# EAGLE design Solar-Charger-Board (EAGLE 8.1.1)
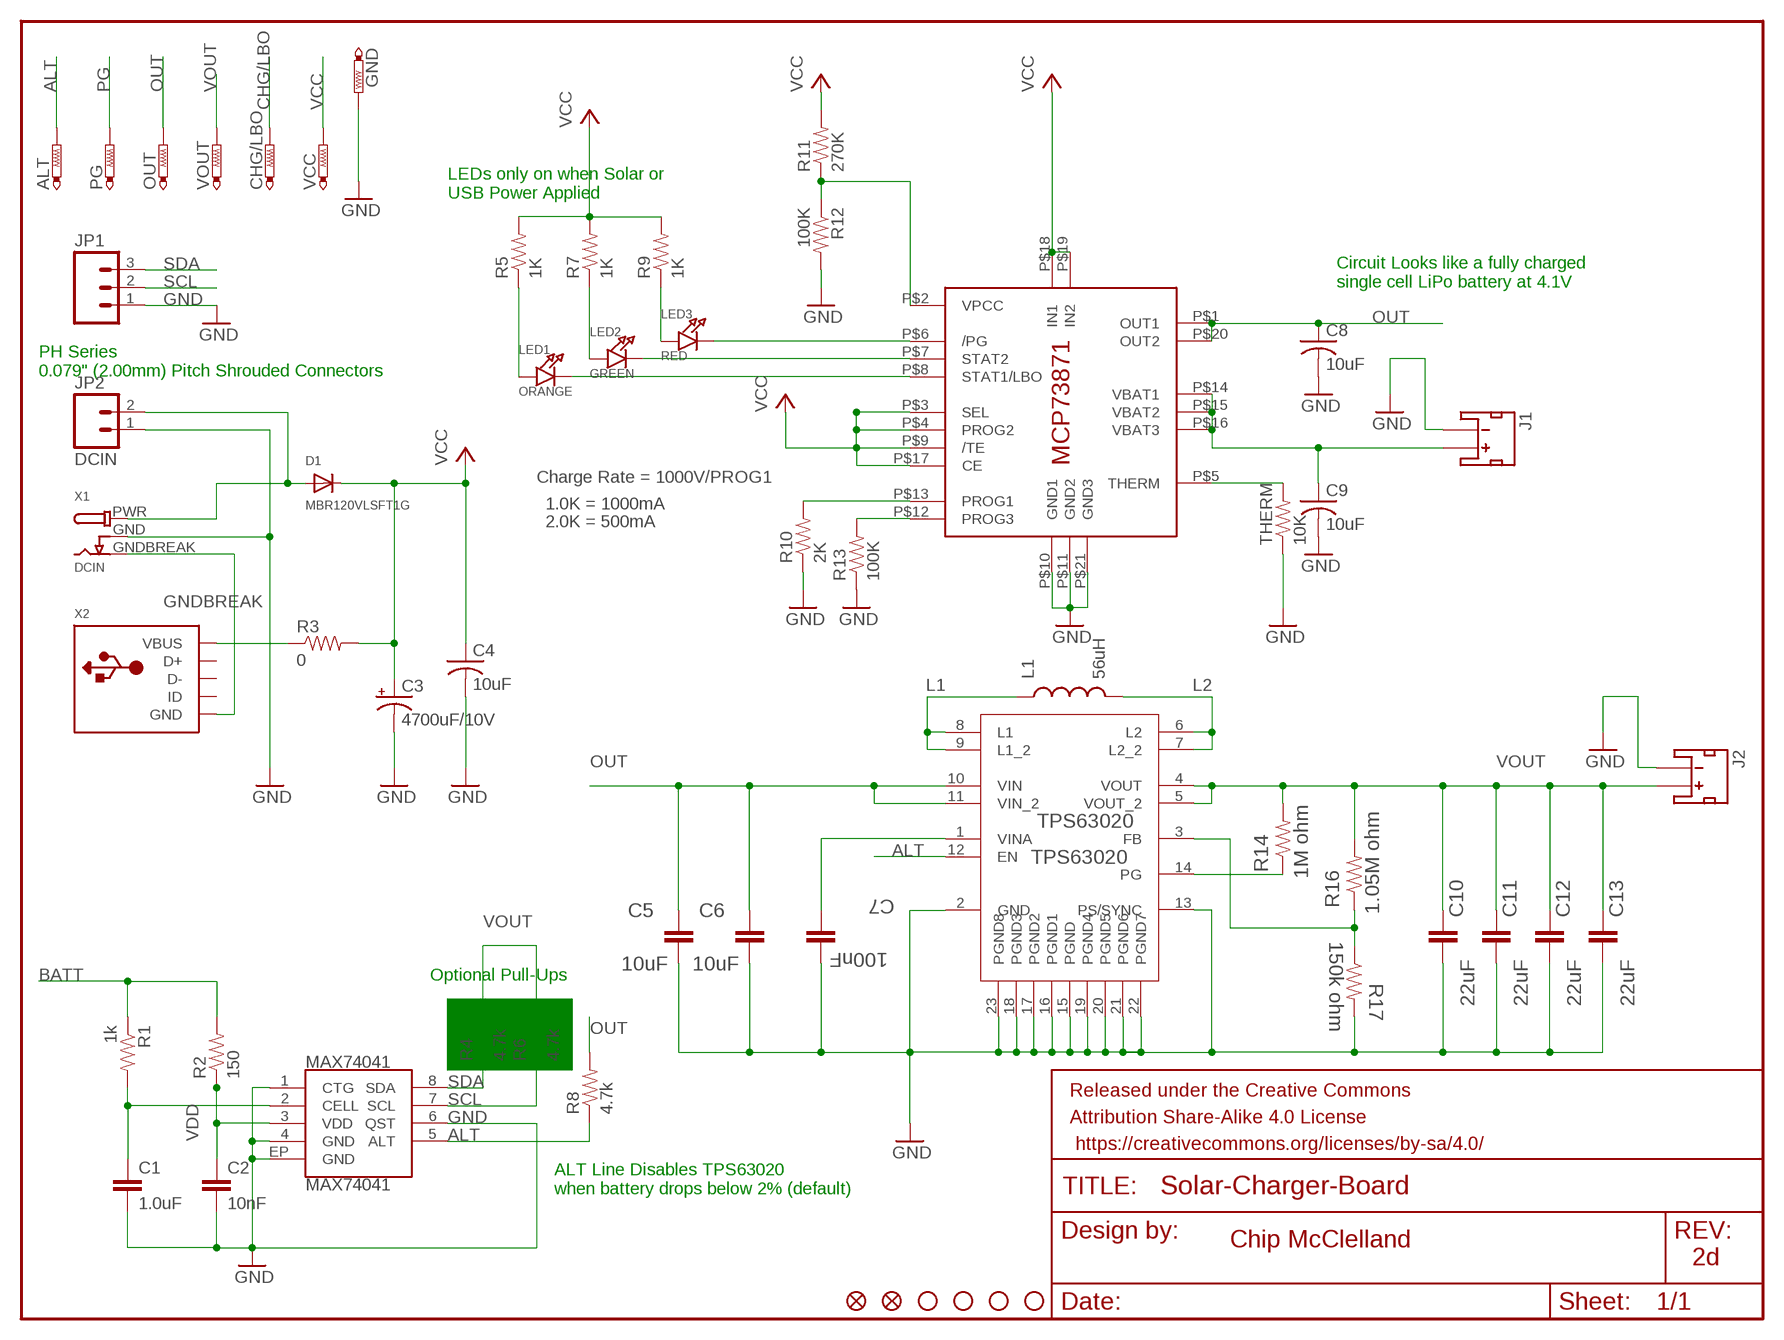
[diagram p0: schematic, sheet 1]

## Parts
ALT  PTR1TP09R  [TP09R]
C1  1.0uF  1.0UF-25V-+80/-20(0805)  [0805]
C2  10nF  2.2UF-25V-+80/-20(0805)  [0805]
C3  4700uF/10V  CPOL-USE5-13  [E5-13]
C4  10uF  C-USC0805K  [C0805K]
C5  10uF  CAP0805  [0805]
C6  10uF  CAP0805  [0805]
C7  100nF  CAP0805  [0805]
C8  10uF  C-USC0805K  [C0805K]
C9  10uF  C-USC0805K  [C0805K]
C10  22uF  CAP0805  [0805]
C11  22uF  CAP0805  [0805]
C12  22uF  CAP0805  [0805]
C13  22uF  CAP0805  [0805]
CHG/LBO  PTR1TP09R  [TP09R]
D1  MBR120VLSFT1G  DIODESOD-123  [SOD-123]
FID1  FIDUCIALUFIDUCIAL  [MICRO-FIDUCIAL]
FID2  FIDUCIALUFIDUCIAL  [MICRO-FIDUCIAL]
FRAME1  FRAME-LETTER  [CREATIVE_COMMONS]
GND  PTR1TP09R  [TP09R]
J1  JST_2MM_MALE  [JST-2-SMD]
J2  JST_2MM_MALE  [JST-2-SMD]
JP1  M03LOCK  [1X03_LOCK]
JP2  DCIN  M02LOCK  [1X02_LOCK]
JP3  STAND-OFF  [STAND-OFF]
JP4  STAND-OFF  [STAND-OFF]
JP5  STAND-OFF  [STAND-OFF]
JP6  STAND-OFF  [STAND-OFF]
L1  56uH  INDUCTORSDR0403-560KL  [SDR0403]
LED1  ORANGE  LED0805_NOOUTLINE  [CHIPLED_0805_NOOUTLINE]
LED2  GREEN  LED0805_NOOUTLINE  [CHIPLED_0805_NOOUTLINE]
LED3  RED  LED0805_NOOUTLINE  [CHIPLED_0805_NOOUTLINE]
MAX74041  MAX74041  MAX1704X  [TDFN-8]
MCP73871  U1  MCP73871  [QFN20_4MM]
OUT  PTR1TP09R  [TP09R]
PG  PTR1TP09R  [TP09R]
R1  1k  RESISTOR0805-RES  [0805]
R2  150  RESISTOR0805-RES  [0805]
R3  0  RESISTOR0805-RES  [0805]
R4  4.7k  RESISTOR0805-RES  [0805]
R5  1K  RESISTOR0805-RES  [0805]
R6  4.7k  RESISTOR0805-RES  [0805]
R7  1K  RESISTOR0805-RES  [0805]
R8  4.7k  RESISTOR0805-RES  [0805]
R9  1K  RESISTOR0805-RES  [0805]
R10  2K  RESISTOR0805-RES  [0805]
R11  270K  RESISTOR0805-RES  [0805]
R12  100K  RESISTOR0805-RES  [0805]
R13  100K  RESISTOR0805-RES  [0805]
R14  1M ohm  RESISTOR0805-RES  [0805]
R16  1.05M ohm  RESISTOR0805-RES  [0805]
R17  150k ohm  RESISTOR0805-RES  [0805]
THERM  10K  RESISTOR0805-RES  [0805]
TPS63020  TPS63020  [QFN14-3X4MM]
VCC  PTR1TP09R  [TP09R]
VOUT  PTR1TP09R  [TP09R]
X1  DCIN  DCBARRELSMT  [DCJACK_2MM_SMT]
X2  USBMINIBLARGE  [USB-MINIB_LARGER]

## Nets
ALT: ALT.TP MAX74041.5(ALT) R8.1 TPS63020.12(EN)
BATT: C9.1 J1.2(+) MCP73871.P$14(VBAT1) MCP73871.P$15(VBAT2) MCP73871.P$16(VBAT3) R1.1 R2.2
CHG/LBO: CHG/LBO.TP LED1.C MCP73871.P$8(STAT1/LBO)
DC-IN: D1.A JP2.2 X1.PWR
DONE: LED2.C MCP73871.P$7(STAT2)
FB: R16.1 R17.1 TPS63020.3(FB)
GND: C1.2 C2.2 C3.- C4.2 C5.2 C6.2 C7.2 C8.2 C9.2 C10.2 C11.2 C12.2 C13.2 GND.TP J1.1(-) J2.1(-) JP1.1 JP2.1 MAX74041.1(CTG) MAX74041.4(GND) MAX74041.6(QST) MAX74041.EP(GND) MCP73871.P$10(GND1) MCP73871.P$11(GND2) MCP73871.P$21(GND3) R10.1 R12.2 R13.1 R17.2 THERM.1 TPS63020.2(GND) TPS63020.13(PS/SYNC) TPS63020.15(PGND) TPS63020.16(PGND1) TPS63020.17(PGND2) TPS63020.18(PGND3) TPS63020.19(PGND4) TPS63020.20(PGND5) TPS63020.21(PGND6) TPS63020.22(PGND7) TPS63020.23(PGND8) X1.GND(GNDBREAK)
GNDBREAK: X1.GNDBREAK(GND) X2.GND X2.GND1(GND) X2.GND2(GND) X2.GND3(GND) X2.GND4(GND)
L1: L1.P$1 TPS63020.8(L1) TPS63020.9(L1_2)
L2: L1.P$2 TPS63020.6(L2) TPS63020.7(L2_2)
N$3: C1.1 MAX74041.2(CELL) R1.2
N$6: MCP73871.P$2(VPCC) R11.1 R12.1
N$7: C7.1 TPS63020.1(VINA)
N$8: MCP73871.P$5(THERM) THERM.2
N$12: LED1.A R5.1
N$13: LED2.A R7.1
N$14: LED3.A R9.1
N$15: MCP73871.P$12(PROG3) R13.2
N$16: MCP73871.P$13(PROG1) R10.2
OUT: C5.1 C6.1 C8.1 MCP73871.P$1(OUT1) MCP73871.P$20(OUT2) OUT.TP R8.2 TPS63020.10(VIN) TPS63020.11(VIN_2)
PG: PG.TP R14.1 TPS63020.14(PG)
PWR: LED3.C MCP73871.P$6(/PG)
SCL: JP1.2 MAX74041.7(SCL) R6.1
SDA: JP1.3 MAX74041.8(SDA) R4.1
VBUS: R3.1 X2.VBUS
VCC: C3.+ C4.1 D1.C MCP73871.P$3(SEL) MCP73871.P$4(PROG2) MCP73871.P$9(/TE) MCP73871.P$17(CE) MCP73871.P$18(IN1) MCP73871.P$19(IN2) R3.2 R5.2 R7.2 R9.2 R11.2 VCC.TP
VDD: C2.1 MAX74041.3(VDD) R2.1
VOUT: C10.1 C11.1 C12.1 C13.1 J2.2(+) R4.2 R6.2 R14.2 R16.2 TPS63020.4(VOUT) TPS63020.5(VOUT_2) VOUT.TP
Unconnected: J1.NC1(PAD1) J1.NC2(PAD2) J2.NC1(PAD1) J2.NC2(PAD2) X2.D+ X2.D- X2.ID

## Notes on the sheet
- LEDs only on when Solar or 
  USB Power Applied
- Circuit Looks like a fully charged
  single cell LiPo battery at 4.1V
- PH Series 
  0.079" (2.00mm) Pitch Shrouded Connectors
- Charge Rate = 1000V/PROG1
- 1.0K = 1000mA
- 2.0K = 500mA
- Optional Pull-Ups
- ALT Line Disables TPS63020
  when battery drops below 2% (default)
- Chip McClelland
- 2d

## Library data of the parts
ALT CHG/LBO GND OUT PG VCC VOUT = testpad:PTR1: TEST PIN
C1 = SparkFun-Capacitors:1.0UF-25V-+80/-20(0805): CAP-11625; PROD_ID: CAP-11625
C2 = SparkFun-Capacitors:2.2UF-25V-+80/-20(0805): CAP-11624; PROD_ID: CAP-11624; VALUE: 2.2uF
C3 = adafruit:CPOL-US: POLARIZED CAPACITOR, American symbol
C4 C8 C9 = adafruit:C-US: CAPACITOR, American symbol
C5-C7 C10-C13 = SparkFun-Passives:CAP: Capacitor Standard 0603 ceramic capacitor, and 0.1" leaded capacitor.
D1 = microbuilder:DIODE: Diode SMA Model Volts Amps Type Vf Vr Digikey # Notes SSA34-E3 40V 3A Schottky 480mV @ 3A 200uA @ 40V SSA34-E3/61TGITR-ND CDBA120-G 20V 1A Schottky 500mV @ 1A 500uA @ 20V 641-1014-6-ND REEL MBRA210 10V 2A Schottky 350mV @ 2A 700uA @ 10V MBRA210LT3 SOD-123 Model Volts Amps Type Vf Vr Order # Notes BAT54T1G 30V 200mA Schottky 800mV @ 200mA 2uA @ 25V BAT54T1GOSTR-ND B0530W 30V 500mA Schottky 430mV @ 500mA 130uA @ 30V B0530W-FDICT-ND REEL MBR120 20V 1A Schottky 340mV @ 1A MBR120VLSFT1GOSCT-ND SOD-323 Model Volts Amps Type Vf Vr Order # Notes PMEG2005EJ 20V 500mA Schottky 355mV @ 500mA 568-4110-1-ND ZLLS410 10V 570mA Schottky 380mV @ 570mA ZLLS410CT-ND 1N4148WS 75V 150mA Silicon/Simple 1V 1N4148WSFSCT-ND REEL SOD-523 Model Volts Amps Type Vf Vr Order # Notes BAT54XV2 30V 200mA Schottky 0.8V @ 100mA BAT54XV2CT-ND TB751S 30V 30mA Schottky RB751S-40TE61CT-ND SOT23-R/W (R = Solder Paste/Reflow Ovens, W = Hand-Soldering) Model Volts Amps Type Vf Vr Order # Notes BAT54FILM 40V 300mA Schottky 497-7162-1-ND
FID1 FID2 = SparkFun-Aesthetics:FIDUCIAL: Fiducial Alignment Points Various fiducial points for machine vision alignment.
FRAME1 = SparkFun-Aesthetics:FRAME-LETTER: Schematic Frame Standard 8.5x11 US Letter frame
J1 J2 = SparkFun-Connectors:JST_2MM_MALE: Mates to single-cell LiPo batteries. CONN-08352; PROD_ID: CONN-08352
JP1 = SparkFun-Connectors:M03: Header 3 Standard 3-pin 0.1" header. Use with straight break away headers (SKU : PRT-00116), right angle break away headers (PRT-00553), swiss pins (PRT-00743), machine pins (PRT-00117), and female headers (PRT-00115). Molex polarized connector foot print use with SKU : PRT-08232 with associated crimp pins and housings.
JP2 = SparkFun-Connectors:M02: Standard 2-pin 0.1" header. Use with - straight break away headers ( PRT-00116) - right angle break away headers (PRT-00553) - swiss pins (PRT-00743) - machine pins (PRT-00117) - female headers (PRT-00115) Molex polarized connector foot print use with: PRT-08233 with associated crimp pins and housings. 2.54_SCREWTERM for use with PRT-10571. 3.5mm Screw Terminal footprints for PRT-08084 5mm Screw Terminal footprints for use with PRT-08433
JP3-JP6 = SparkFun:STAND-OFF: Stand Off This is the mechanical footprint for a #4 phillips button head screw. Use the keepout ring to avoid running the screw head into surrounding components. SKU : PRT-00447
L1 = SparkFun-Passives:INDUCTOR: Inductors Basic Inductor/Choke - 0603 and 1206. Footprints are not proven and vary greatly between part numbers. SRN6045- 33uH, 20% 1.4A SDR0403-560KL - 56uH, 10%, 500mA RMS/740mA peak; DIST: DIGIKEY; DIST_ID: SDR0403-560KLCT-ND
LED1-LED3 = microbuilder:LED: LED 0603 - 0603 Surface Mount Package 2mA: Green LED - Low Power (3.9mcd, 2ma, 1.7Vf) - Digikey: 475-2709-2-ND Orange LED - Low Power (9.8mcd, 2ma, 1.8Vf) - Digikey: 475-1194-2-ND Red LED - Low Power (5mcd, 2ma, 1.8Vf) - Digikey: 475-1195-2-ND Yellow LED - Low Power (7mcd, 2ma, 1.8Vf) - Digikey: 475-1196-2-ND 5mA: Blue LED - Low Power (17mcd, 5ma, 2.9Vf) - Digikey: LNJ937W8CRACT-ND 0805 - 0805 Surface Mount Package 2mA: Red LED (8.8mcd, 2mA, 1.8Vf, Clear) - Low Power [Digikey: 475-2510-1-ND] Green LED (5mcd, 2mA, 1.8Vf, Clear) - Low Power [Digikey: 475-2730-1-ND] Yellow LED (11.3mcd, 2mA, 1.8Vf, Clear) - Low Power [Digikey: 475-2555-1-ND] 20mA: Red LED (104mcd, 20mA, Diffused) - LS R976 [Digikey: 475-1278-6-ND] Red LED (12mcd, 20mA, 2.0Vf, Clear) - APT2012EC [Digikey: 754-1128-1-ND] Green LED (15mcd, 20mA, 2.2Vf, Clear) - APT2012GC [Digikey: 754-1131-1-ND] Orange LED (160mcd, 20mA, 2.1Vf, Clear) - APT2012SECK [Digikey: 754-1130-1-ND] 1206 - 1206 Surface Mount Package Green LED (26mcd, 20mA, Diffused) - LG N971 [Digikey: 475-1407-6-ND] Red LED (15mcd, 20mA, Diffused) - LH N974 [Digikey: 475-1416-6-ND] Cree - Cree High-Power Surface Mount LEDs XPEBWT-L1-0000-00D50 - White 111lm 350mA 2.9Vf 6200K 110° XTEAWT-00-0000-00000LEE3 - White 114lm 350mA 2.85Vf 5000K 115° Everlight - Everlight 45-21 Series Surface Mount LEDs 45-21/QK2C-B2832AC2CB2/2T - Warm White 2000mcd 20mA 3.25Vf 3050K 120° 45-21/LK2C-B38452C4CB2/2T - Nuetral White 2000mcd 20mA 3.25Vf 4150K 120° 45-21/LK2C-B50634C6CB2/2T - Cold White 2200mcd 20mA 3.25Vf 5650K 120° PLCC2 Reverse Mount LS T77K-J1L2-1-0-2-R18-Z - Red 11.25mcd 2mA 1.8Vf 630nm 120° LO T77K-L1M2-24-Z - Orange 19.6mcd 2mA 1.8Vf 606nm 120° LY T77K-K2M1-26-Z - Yellow 15.7mcd 2mA 1.8Vf 587nm 120°
MAX74041 = SparkFun:MAX1704X: MAX17043/MAX17044: Battery Fuel Guage (43 is 1cell, 44 is 2cell)
MCP73871 = adafruit:MCP73871
R1-R14 R16 R17 THERM = SparkFun-Passives:RESISTOR: Resistor Basic schematic elements and footprints for 0603, 1206, and PTH resistors.
TPS63020 = TI Power and Battery:TPS63020
X1 = microbuilder:DCBARREL: DC Barrel Jack DCJACK_1.3MM_PTH - Through Hole 1.3mm Jack (4UConnector: 05536) DCJACK_2MM_PTH - Through Hole 2.0/2.1 Jack (4UConnector: 05537) DCJACK_2MM_SMT - SMT 2.0/2.1mm Jack(4UConnector: 03267)
X2 = microbuilder:USB: USB Connectors USBMINIB - Surface Mount Female Mini-B USB Connector 4UConnector: 06564

## Net classes
0 default: width 0.203 mm, drill 0.33 mm

## Board
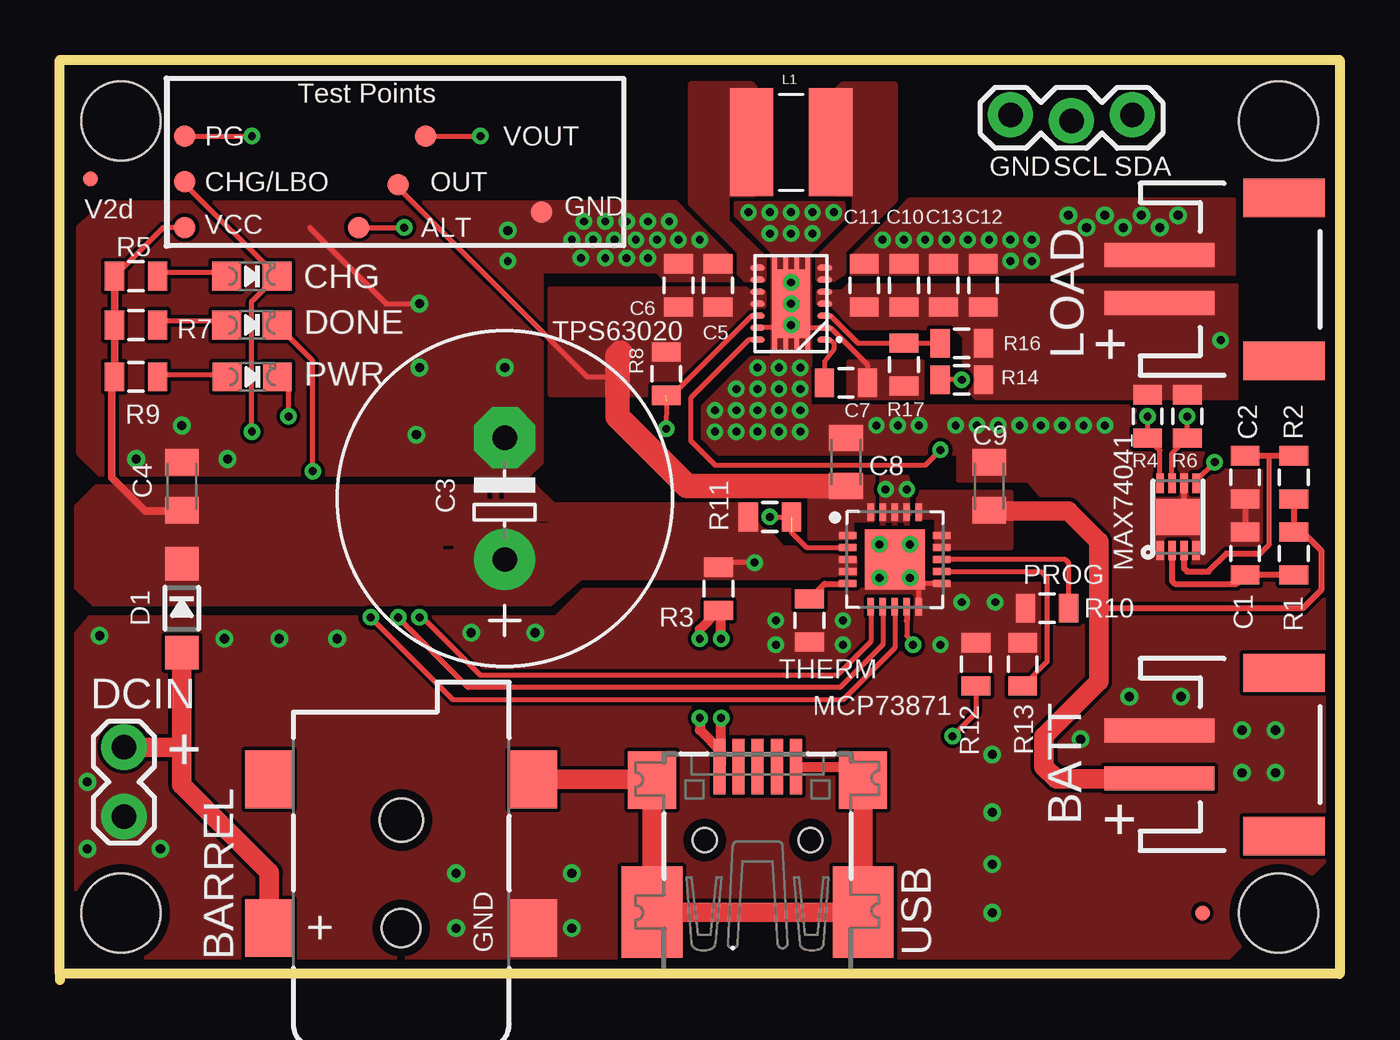
[diagram p1: board, top side]
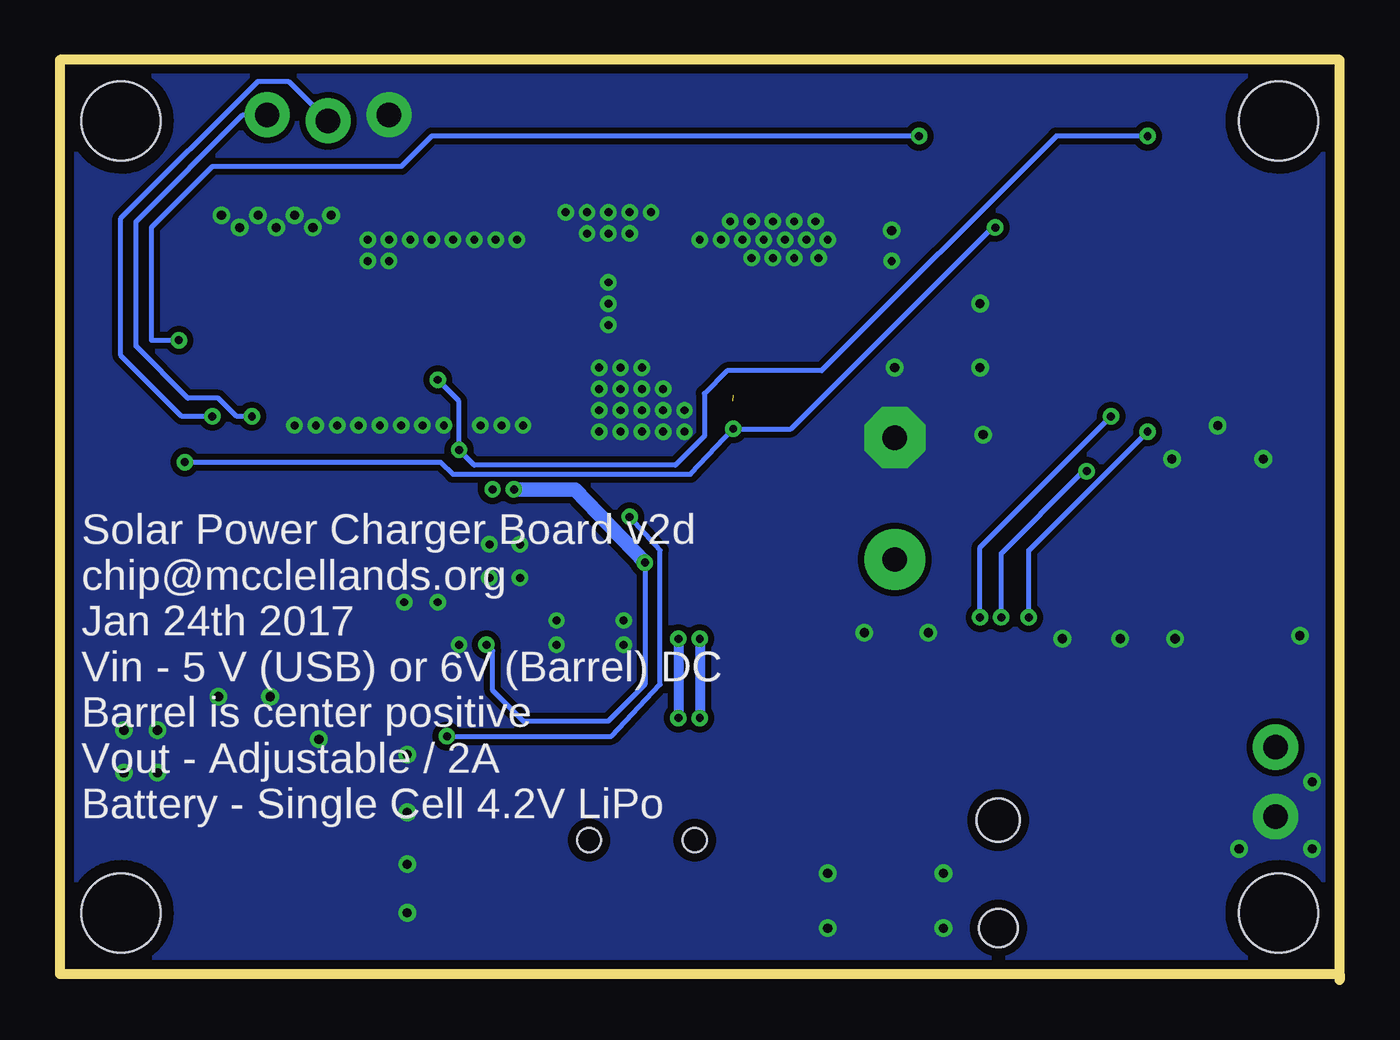
[diagram p2: board, bottom side, seen from below]

Size 53.34 x 38.35 mm. Coordinates in mm from the lower left corner, seen from the top.
Outline: 0,0.25 0,38.35 53.34,38.35 53.34,0.25 0,0.25
Outline: 0,0.25 0,0
Copper layers (1*16): Top 0.0356mm / dielectric 1.5011mm / Bottom 0.0356mm
Design rules "LaenPCBOrder": minimum track width 6mil, minimum drill 13mil, track to track 6mil, track to pad 6mil, pad to pad 6mil, via to via 6mil, smd to smd 6mil, copper to edge 15mil, drill to drill 6mil, minimum pad ring 7mil, minimum via ring 7mil, stop-mask expansion 3mil, vias tented up to drill 0mil, thermal gap 10mil
tRestrict: area 16,18 to 16.4,18.1; 9 lines

### Footprints (pad centres in the part's own frame; a part is rotated, then mirrored left to right if it is on the bottom)
TP09R = smd 0.9 x 0.9: TP 0,0
0805 = smd 0.8 x 1.2: 1 -0.9,0; 2 0.9,0
E5-13 = drill 1.016 pad 2.54: + -2.54,0 | drill 1.016 pad 2.54 octagon: - 2.54,0
C0805K = smd 1.1 x 1.4: 1 -1,0; 2 1,0
SOD-123 = smd 1.4 x 1.4: A 1.85,0; C -1.85,0
MICRO-FIDUCIAL = smd 0.635 x 0.635: 1 0,0
JST-2-SMD = smd 1 x 4.6: 1 -1,-3.7; 2 1,-3.7 | smd 1.6 x 3.4: NC1 -3.4,1.5; NC2 3.4,1.5
1X03_LOCK = drill 1.016 pad 1.88: 1 0,0.127; 2 2.54,-0.127; 3 5.08,0.127
1X02_LOCK = drill 1.016 pad 1.88: 1 -0.178,0; 2 2.718,0
STAND-OFF = hole 3.302: 0,0
SDR0403 = smd 1.8 x 4.5: P$1 -1.65,0; P$2 1.65,0
CHIPLED_0805_NOOUTLINE = smd 1.2 x 1.2: A 0,-1.05; C 0,1.05
TDFN-8 = smd 0.8 x 0.3: 1 -1.4,0.75; 2 -1.4,0.25; 3 -1.4,-0.25; 4 -1.4,-0.75; 5 1.4,-0.75; 6 1.4,-0.25; 7 1.4,0.25; 8 1.4,0.75 | smd 1.5 x 1.88: EP 0,0
QFN20_4MM = smd 0.73 x 0.28: P$1 -1.965,1; P$2 -1.965,0.5; P$3 -1.965,0; P$4 -1.965,-0.5; P$5 -1.965,-1; P$11 1.965,-1; P$12 1.965,-0.5; P$13 1.965,0; P$14 1.965,0.5; P$15 1.965,1 | smd 0.28 x 0.73: P$6 -1,-1.965; P$7 -0.5,-1.965; P$8 0,-1.965; P$9 0.5,-1.965; P$10 1,-1.965; P$16 1,1.965; P$17 0.5,1.965; P$18 0,1.965; P$19 -0.5,1.965; P$20 -1,1.965 | smd 2.5 x 2.5: P$21 0,0
QFN14-3X4MM = smd 0.6 x 0.24: 1 -1.4,1.5; 2 -1.4,1; 3 -1.4,0.5; 4 -1.4,0; 5 -1.4,-0.5; 6 -1.4,-1; 7 -1.4,-1.5; 8 1.4,-1.5; 9 1.4,-1; 10 1.4,-0.5; 11 1.4,0; 12 1.4,0.5; 13 1.4,1; 14 1.4,1.5 | smd 1.58 x 2.85: 15 0,0 | smd 0.2 x 0.575: 16 -0.69,1.712; 17 -0.23,1.712; 18 0.23,1.712; 19 0.69,1.712; 20 0.69,-1.712; 21 0.23,-1.712; 22 -0.23,-1.712; 23 -0.69,-1.712
DCJACK_2MM_SMT = smd 2.4 x 2: GND 0,-5.5; GNDBREAK 6.2,-5.5; PWR 0,5.5; PWR2 6.2,5.5 | hole 1.6: 0,0 | hole 1.8: 4.5,0
USB-MINIB_LARGER = smd 0.5 x 2.308: D+ 0,4.064; D- -0.8,4.064; GND 1.6,4.064; ID 0.8,4.064; VBUS -1.6,4.064 | smd 2.54 x 3.81: GND1 -4.4,-2; GND4 4.4,-2 | smd 2 x 2.4: GND2 -4.4,3.5; GND3 4.4,3.5 | hole 1: -2.2,1; 2.2,1

### Placement (x,y rotation side)
ALT  12.45,31.37 0 top
C1  49.4,17.78 90 top
C2  49.4,20.96 270 top
C3  18.54,20.07 90 top
C4  5.08,20.57 90 top
C5  27.43,28.96 90 top
C6  25.78,28.96 90 top
C7  32.77,24.89 0 top
C8  32.77,21.59 90 top
C9  38.73,20.57 90 top
C10  35.18,28.96 90 top
C11  33.53,28.96 90 top
C12  38.48,28.96 90 top
C13  36.83,28.96 90 top
CHG/LBO  5.21,33.27 0 top
D1  5.08,15.49 270 top
FID1  47.62,2.79 0 top
FID2  1.27,33.4 0 top
FRAME1  0,0.25 0 top
GND  20.07,32 0 top
J1  49.53,9.4 270 top
J2  49.53,29.21 270 top
JP1  39.62,35.94 0 top
JP2  2.67,6.98 90 top
JP3  50.8,35.81 0 top
JP4  50.8,2.79 0 top
JP5  2.54,35.81 0 top
JP6  2.54,2.79 0 top
L1  30.48,34.92 0 top
LED1  8,29.34 270 top
LED2  8,27.3 270 top
LED3  8.02,25.15 270 top
MAX74041  46.61,19.3 90 top
MCP73871  34.8,17.53 0 top
OUT  14.1,33.15 0 top
PG  5.21,35.18 0 top
R1  51.44,17.78 270 top
R2  51.44,20.96 270 top
R3  27.46,16.31 90 top
R4  45.34,23.5 90 top
R5  3.17,29.34 180 top
R6  46.99,23.5 90 top
R7  3.17,27.3 180 top
R8  25.27,25.27 90 top
R9  3.17,25.15 180 top
R10  41.15,15.49 0 top
R11  29.59,19.3 180 top
R12  38.18,13.16 90 top
R13  40.13,13.16 270 top
R14  37.59,25.02 0 top
R16  37.59,26.54 0 top
R17  35.18,25.65 270 top
THERM  31.24,14.99 90 top
TPS63020  30.48,28.19 180 top
VCC  5.21,31.37 0 top
VOUT  15.24,35.18 0 top
X1  14.22,2.16 90 top
X2  29.08,4.83 0 top

### Tracks (layer width: path | path; a pad name or v marks a point on that pad's centre or on a via)
ALT  (via drill 0.33)  (1 unrouted)
  Top 0.203: TPS63020.12 28.84,27.69 25.91,24.77 25.28,24.13 v25.27,22.98 | MAX74041.5 47.36,20.82 v48.13,21.59 | ALT.TP v14.35,31.37
  Top 0.254: v14.35,31.37 14.48,31.37
  Bottom 0.203: v48.13,21.59 37.47,21.59 36.96,21.08 27.05,21.08 25.27,22.99 v25.27,22.98 22.87,22.98 14.48,31.37 v14.35,31.37
BATT
  Top 0.203: 35.76,19.61 MCP73871.P$16
  Top 0.254: R2.2 R1.1 51.8,18.68 52.58,17.91 52.58,16.26 51.82,15.49 43.56,15.49 43.31,15.75
  Top 0.813: C9.1 38.75,19.56 42.04,19.56 43.31,18.29 43.31,15.75 43.31,12.45 41.02,10.16 41.02,8.89 41.53,8.38 45.81,8.38 J1.2
  pour Top (no thermals): 35.81,19.3 35.81,20.32 39.62,20.32 39.62,18.03 36.58,18.03 36.58,19.3
CHG/LBO  (via drill 0.33)
  Top 0.203: LED1.C 8.76,29.34 | MCP73871.P$8 34.8,13.84 32.64,11.68 16.38,11.68 v12.95,15.11 | v8,22.86 8,28.29 LED1.C | CHG/LBO.TP 5.21,33.18 LED1.C
  Bottom 0.203: v12.95,15.11 12.95,17.91 v8,22.86
DC-IN
  Top 0.813: X1.PWR 8.72,4.48 5.08,8.13 5.08,9.65 | 5.08,9.65 D1.A | JP2.2 5.03,9.7 5.08,9.65
DONE  (via drill 0.33)
  Top 0.203: MCP73871.P$7 34.3,13.98 32.51,12.19 17.02,12.19 v14.1,15.11 | v10.54,21.21 10.54,25.82 LED2.C
  Bottom 0.203: v14.1,15.11 14.1,17.78 10.79,21.08 10.67,21.08 v10.54,21.21
FB
  Top 0.203: TPS63020.3 32.12,27.69 33.27,26.54 34.94,26.54 R17.1 R16.1
GND  (via drill 0.33, 0.38)
  Top 0.203: MCP73871.P$11 35.58,16.53 35.56,16.51 35.81,16.51 | 35.81,15.49 35.81,16.51 | 35.81,16.51 MCP73871.P$21 | 10.41,31.37 13.59,28.19 v14.99,28.19 | 30.46,27.19 TPS63020.13 | 30.46,27.19 30.48,27.18 | 30.46,27.19 TPS63020.2 32.12,27.19 33.66,25.65 33.66,24.9 C7.2
  Top 0.254: C2.2 C1.2 | MAX74041.6 46.86,19.55 MAX74041.EP
  other vias: 38.86,9.4 1.14,8.25 16.51,4.45 38.99,15.75 14.86,22.73 43.56,31.88 46.61,31.88 50.67,8.64 50.67,10.41 38.86,6.98 42.8,31.37 44.32,31.37 45.09,31.88 45.85,31.37 30.48,29.08 30.48,28.19 30.48,27.3 28.7,32 29.59,32 30.48,32 31.37,32 31.37,31.12 30.48,31.12 29.59,31.12 34.29,30.86 35.18,30.86 36.07,30.86 26.67,30.86 25.78,30.86 24.89,30.86 30.86,25.53 29.97,25.53 28.19,24.64 27.3,22.86 35.43,18.16 34.16,18.16 34.16,16.76 35.43,16.76 18.67,31.24 5.08,23.11 14.99,25.53 18.54,25.53 6.99,21.72 3.17,21.72 32.64,14.99 32.64,13.97 29.84,13.97 29.84,14.99 37.59,15.75 36.7,13.97 4.19,5.46 1.14,5.46 21.34,4.45 21.34,2.16 16.51,2.16 44.58,11.81 46.74,11.81 49.28,10.41 42.55,10.03 49.28,8.64 38.86,4.83 38.86,2.79 19.81,14.48 17.14,14.48 11.56,14.22 9.14,14.22 6.86,14.22 1.65,14.35 32.26,32 24,30.86 23.11,30.86 22.23,30.86 21.34,30.86 21.72,30.1 22.73,30.1 23.62,30.1 24.51,30.1 25.4,31.62 24.51,31.62 18.67,29.97 21.84,31.62 22.73,31.62 23.62,31.62 36.96,30.86 37.85,30.86 38.73,30.86 39.62,30.86 39.62,29.97 40.51,29.97 40.51,30.86 29.08,25.53 30.86,24.64 29.97,24.64 29.08,24.64 42.04,31.88 30.86,23.75 29.97,23.75 29.08,23.75 27.3,23.75 28.19,23.75 28.19,22.86 29.08,22.86 29.97,22.86 34.04,23.11 34.92,23.11 35.81,23.11 37.34,23.11 38.23,23.11 39.12,23.11 40.01,23.11 40.89,23.11 41.78,23.11 42.67,23.11 43.56,23.11 30.86,22.86
  pour Bottom (isolate 0.254, no thermals): -3.94,-4.32 -3.94,39.78 54.65,39.65 54.78,-4.06
  pour Top (no thermals): 41.15,16.51 41.15,12.95 35.81,12.95 35.81,16.51
  pour Top (no thermals): 1.27,15.11 20.7,15.11 21.84,16.26 40.77,16.26 41.91,17.27 41.91,19.05 40.39,20.83 37.47,20.83 37.47,23.88 52.83,23.88 53.09,5.33 48.51,0.76 2.79,0.76 0.51,3.05 0.51,14.22
  pour Top (rank 2, no thermals): 27.94,30.1 25.65,32.38 20.19,32.38 20.19,29.59 24.89,29.59 25.27,29.21 27.94,29.21
  pour Top (rank 2, no thermals): 33.02,30.1 35.43,32.51 48.9,32.51 48.9,29.46 33.02,29.46
  pour Top (no thermals): 32.89,25.78 35.94,25.78 35.94,24.26 32.89,24.26
  pour Top (rank 2, no thermals): 28.19,32.38 32.64,32.38 32.64,31.75 31.24,30.35 31.24,24.64 29.72,24.64 29.72,30.35 28.19,31.88
  pour Top (rank 2, no thermals): 30.35,25.91 28.83,25.91 26.8,23.88 26.8,22.61 27.43,21.97 49.15,21.97 49.15,23.88 31.24,23.88 31.24,25.91
  pour Top (rank 2, no thermals): 20.07,32.38 1.91,32.38 0.76,31.37 0.76,21.97 1.65,21.08 19.56,21.08 20.07,21.59
GNDBREAK
  Top 0.406: 24.65,8.36 X2.GND2 | X2.GND 32.92,8.89 X2.GND3
  Top 0.813: X2.GND3 X2.GND4 X2.GND1 X2.GND2 24.68,8.36 X1.GNDBREAK
L1
  pour Top (no thermals): 28.96,32.77 28.96,37.21 28.83,37.34 26.29,37.34 26.29,32.38 28.32,30.35 28.32,29.46 28.57,29.21 29.34,29.21 29.34,30.1 27.81,31.62 27.81,32.77
L2
  pour Top (no thermals): 32.38,32.77 32.38,37.08 32.64,37.34 34.8,37.34 34.8,32.51 32.64,30.35 32.64,29.46 32.26,29.21 31.62,29.21 31.62,30.1 33.15,31.62 33.15,32.77
N$3
  Top 0.254: MAX74041.2 46.35,16.64 46.48,16.51 49.03,16.51 C1.1 R1.2
N$6  (via drill 0.33)  (1 unrouted)
  Top 0.203: 30.49,18.66 31.11,18.03 MCP73871.P$2 | R12.1 38.18,11.13 v37.21,10.16 | v29.59,19.3 R11.1
  Bottom 0.203: v37.21,10.16 30.35,10.16 28.32,12.32 28.32,17.91 v29.59,19.3
N$7
  Top 0.203: TPS63020.1 32.11,26.69 32.26,26.54 32.26,26.29 31.88,25.78 C7.1
N$8
  Top 0.203: 32.92,16.56 MCP73871.P$5
  Top 0.254: THERM.2 31.25,15.89 31.88,16.51 32.82,16.51 MCP73871.P$5
N$12
  Top 0.203: LED1.A 6.86,29.52 4.22,29.52 R5.1
N$13
  Top 0.203: LED2.A 6.86,27.48 4.22,27.48 R7.1
N$14
  Top 0.203: LED3.A 6.86,25.25 4.22,25.25 R9.1
N$15
  Top 0.203: MCP73871.P$12 40.89,17.03 41.15,16.76 41.15,13.28 R13.2
N$16
  Top 0.203: R10.2 42.05,17.39 41.91,17.53 MCP73871.P$13
OUT
  Top 0.203: OUT.TP 13.97,33.15 21.97,25.15 23.24,25.15
  Top 1.016: C8.1 26.15,20.59 23.24,23.5 23.24,25.15 23.24,26.04 23.37,26.16
  pour Top (no thermals): 33.91,19.18 33.91,20.96 31.24,20.96 31.24,18.42 33.02,18.42 33.02,19.18
  pour Top (no thermals): 29.34,28.07 28.83,28.07 28.07,27.43 25.02,24.38 20.45,24.38 20.45,28.83 28.57,28.83 28.7,28.7 29.34,28.7
PG  (via drill 0.33)
  Top 0.203: TPS63020.14 28.73,26.69 26.29,24.26 26.29,22.48 27.3,21.46 36.07,21.46 v36.7,22.1 | v37.59,25.02 R14.1 | PG.TP v8,35.18
  Bottom 0.203: v37.59,25.02 36.7,24.13 v36.7,22.1 36.07,21.46 27.69,21.46 26.48,22.67 26.48,24.45 25.53,25.4 21.59,25.4 11.81,35.18 v8,35.18
PWR  (via drill 0.33)
  Top 0.203: MCP73871.P$6 33.8,14.11 32.38,12.7 17.53,12.7 15.11,15.11 v14.99,15.11 | v9.53,23.5 9.53,24.69 LED3.C
  Bottom 0.203: v14.99,15.11 14.99,18.03 v9.53,23.5
SCL  (via drill 0.33)
  Top 0.203: MAX74041.7 46.36,21.96 R6.1 v46.99,23.5
  Bottom 0.203: v46.99,23.5 48.26,23.5 50.8,26.04 50.8,31.75 45.09,37.46 43.81,37.46 JP1.2
SDA  (via drill 0.33)
  Top 0.203: MAX74041.8 45.86,22.08 R4.1 v45.34,23.5
  Bottom 0.203: v45.34,23.5 45.97,23.5 46.74,24.26 48.01,24.26 50.16,26.42 50.16,31.62 45.72,36.07 JP1.3
VBUS  (via drill 0.33)
  Top 0.406: v27.56,14.22 27.56,15.3 R3.1 26.67,14.62 v26.67,14.22 | 27.56,9.53 v27.56,10.92 | 27.56,9.53 27.56,8.97 X2.VBUS | v26.67,10.92 26.67,10.41 27.56,9.53
  Bottom 0.406: v26.67,14.22 v26.67,10.92 | v27.56,14.22 v27.56,10.92
VCC  (via drill 0.33)
  Top 0.203: MCP73871.P$9 35.3,14.36 35.31,14.35 v35.56,13.97 | v28.96,17.4 27.24,17.4 R3.2 | VCC.TP 4.31,31.37 R5.2
  Top 0.254: 5.06,19.56 C4.1 | MCP73871.P$9 35.31,15.55 35.31,14.99
  Top 0.305: 5.06,19.56 3.56,19.56 2.16,20.96 2.16,25.13 R9.2 R7.2 R5.2
  Bottom 0.203: v28.96,17.4 28.96,12.32 30.48,10.79 34.04,10.79 35.31,12.06 35.31,13.72 v35.56,13.97
  Bottom 0.61: v34.42,20.45 31.88,20.45 v28.96,17.4
  other vias: 35.31,20.45
  pour Top (no thermals): 33.15,16.76 21.72,16.76 20.45,15.67 1.4,15.67 0.51,16.51 0.51,19.56 1.52,20.57 19.81,20.57 20.57,19.81 28.57,19.81 30.1,18.03 32,18.03 32.51,17.53 33.15,17.53
  pour Top (rank 2, no thermals): 35.31,19.18 34.29,19.18 34.29,20.96 35.31,20.96
  pour Top (rank 2): 34.16,19.05 35.43,19.05 35.43,20.57 34.04,20.57 34.04,19.05
VDD
  Top 0.203: 50.04,17.78 50.42,18.16 50.42,21.86
  Top 0.254: C2.1 50.42,21.86 R2.1 | 50.04,17.78 48.64,17.78 47.88,17.02 46.99,17.02 46.86,17.14 MAX74041.3
VOUT  (via drill 0.33)
  Top 0.203: VOUT.TP v17.53,35.18
  Bottom 0.203: v17.53,35.18 37.85,35.18 39.12,33.91 46.99,33.91 49.53,31.37 49.53,26.67 v48.39,26.67
  pour Top (no thermals): 31.75,28.7 32.64,28.7 32.89,28.96 49.02,28.96 49.02,27.18 49.02,24.26 38.23,24.26 37.72,24.77 37.72,26.8 37.34,27.18 33.15,27.18 32.13,28.19 31.62,28.19 31.62,28.7

### Text on the board
tPlace: Test Points | GND | SCL | SDA | V2d | CHG | DONE | LOAD | PWR | + | PROG | DCIN | BATT | + | BARREL | + | USB
bPlace: Solar Power Charger Board v2d / chip@mcclellands.org / Jan 24th 2017 / Vin - 5 V (USB) or 6V (Barrel) DC / Barrel is center positive / Vout - Adjustable / 2A / Battery - Single Cell 4.2V LiPo